# EAGLE design rapidshark-flywheel-controller-mk-1.0 (EAGLE 6.5.0)
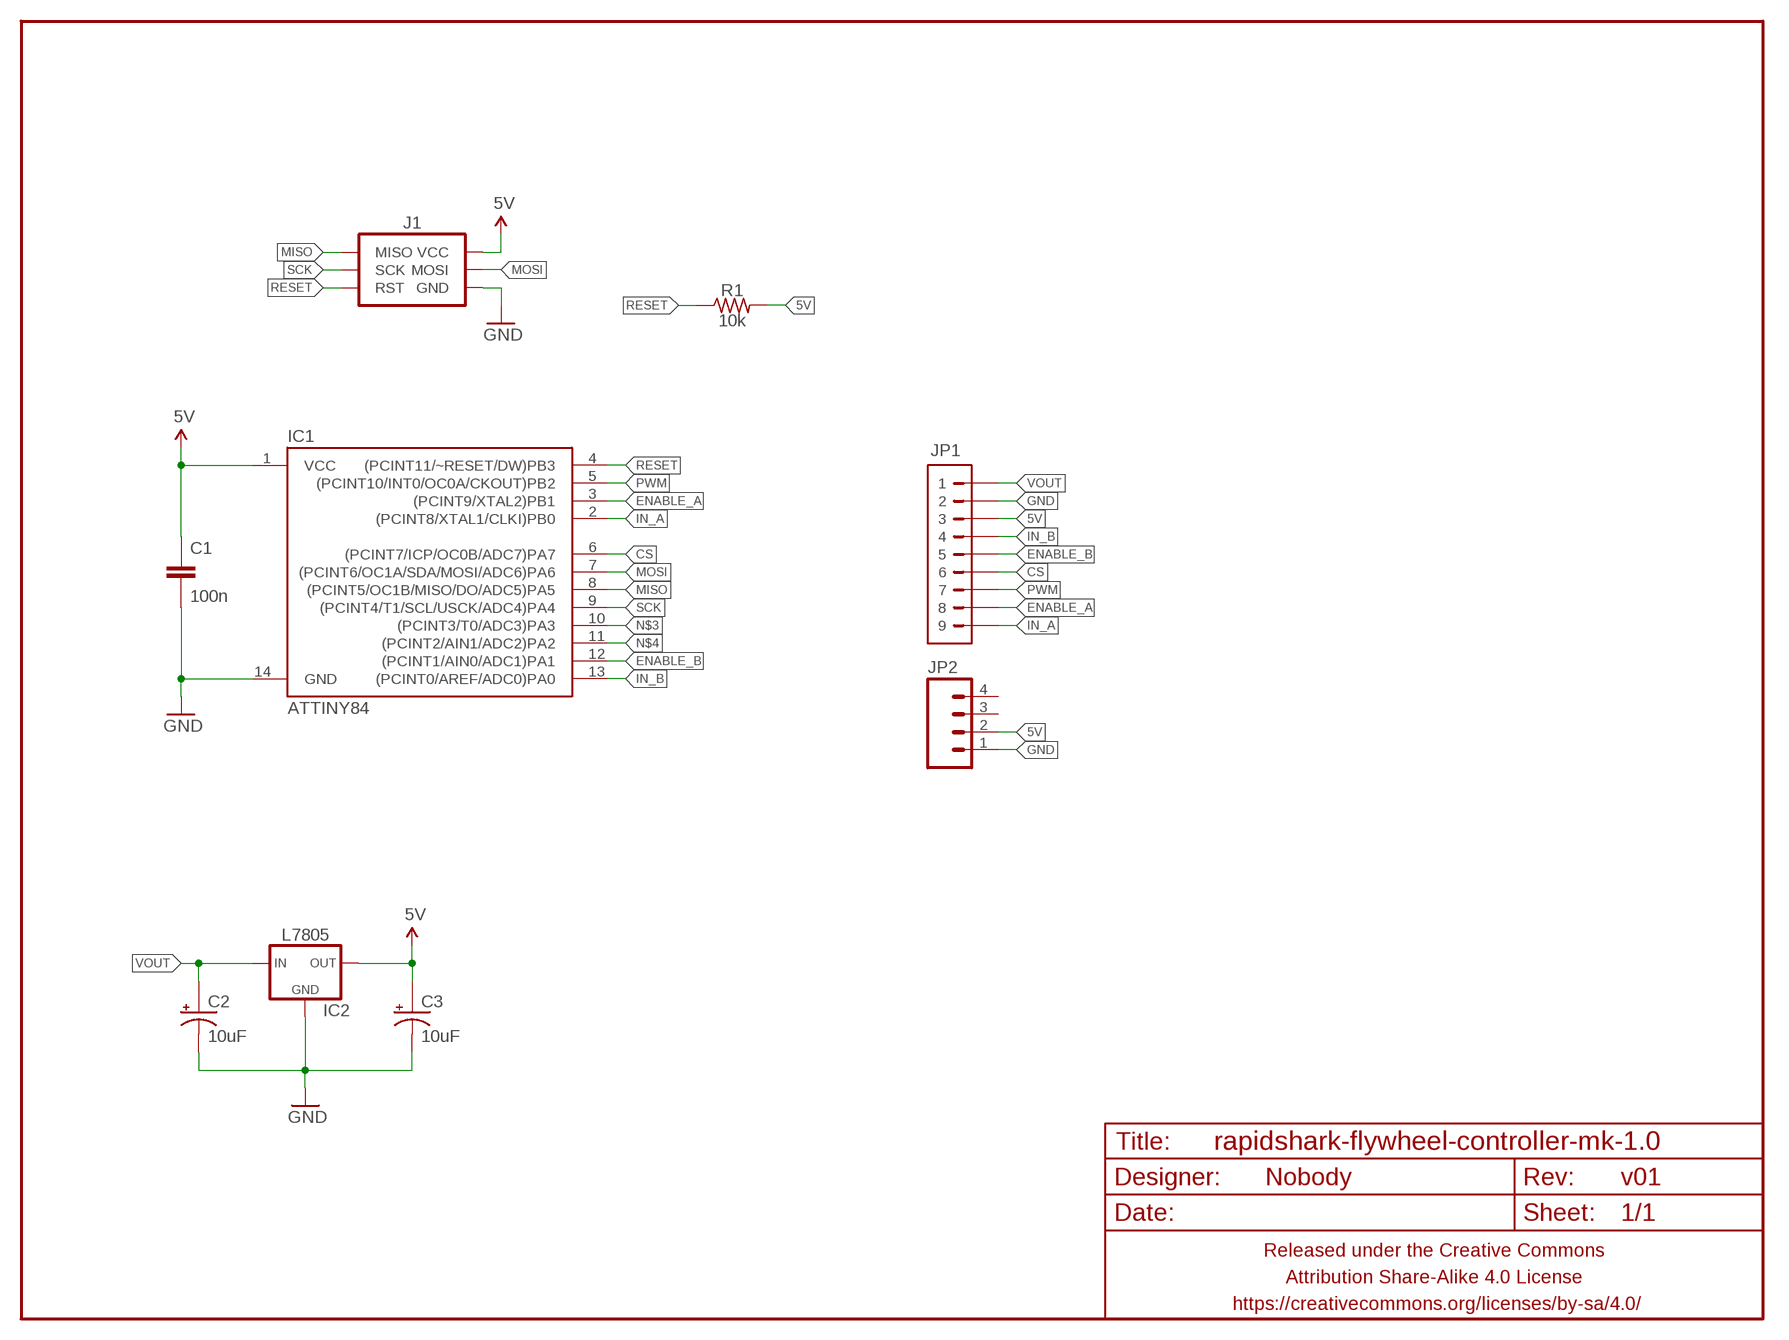
[diagram p0: schematic, sheet 1]

## Parts
C1  100n  CAPACITOR-CERAMICC0805  [C0805]
C2  10uF  CAPACITOR-POLARIZEDE2-5  [E2-5]
C3  10uF  CAPACITOR-POLARIZEDE2-5  [E2-5]
FRAME1  FRAME-LETTERNO_PACKAGE  [DUMMY]
IC1  ATTINY84  [SO14]
IC2  L7805  V_REG_78XXTO-92-INLINE  [TO-92-AMMO]
J1  AVR_SPI_PRG_6PTH  [2X3]
JP1  M09CENTERED  [1X09-CENTERED]
JP2  M04JST-PTH-VERT  [JST-4-PH-VERT-PTH]
R1  10k  RESISTORR0805  [R0805]

## Nets
5V: C1.1 C3.+ IC1.1(VCC) IC2.3(OUT) J1.2(VCC) JP1.3 JP2.2 R1.2
CS: IC1.6((PCINT7/ICP/OC0B/ADC7)PA7) JP1.6
ENABLE_A: IC1.3((PCINT9/XTAL2)PB1) JP1.8
ENABLE_B: IC1.12((PCINT1/AIN0/ADC1)PA1) JP1.5
GND: C1.2 C2.- C3.- IC1.14(GND) IC2.2(GND) J1.6(GND) JP1.2 JP2.1
IN_A: IC1.2((PCINT8/XTAL1/CLKI)PB0) JP1.9
IN_B: IC1.13((PCINT0/AREF/ADC0)PA0) JP1.4
MISO: IC1.8((PCINT5/OC1B/MISO/DO/ADC5)PA5) J1.1(MISO)
MOSI: IC1.7((PCINT6/OC1A/SDA/MOSI/ADC6)PA6) J1.4(MOSI)
N$3: IC1.10((PCINT3/T0/ADC3)PA3)
N$4: IC1.11((PCINT2/AIN1/ADC2)PA2)
PWM: IC1.5((PCINT10/INT0/OC0A/CKOUT)PB2) JP1.7
RESET: IC1.4((PCINT11/~RESET/DW)PB3) J1.5(RST) R1.1
SCK: IC1.9((PCINT4/T1/SCL/USCK/ADC4)PA4) J1.3(SCK)
VOUT: C2.+ IC2.1(IN) JP1.1
Unconnected: JP2.3 JP2.4

## Library data of the parts
C1 = A_butts:CAPACITOR-CERAMIC: CAPACITOR, European symbol
C2 C3 = A_butts:CAPACITOR-POLARIZED: POLARIZED CAPACITOR, American symbol
FRAME1 = A_butts:FRAME-LETTER: Schematic Frame Standard 8.5x11 US Letter frame; DESIGNER: Nobody; VERSION: v01
IC1 = A_butts:ATTINY84: Atmel 14-pin 2/4/8kB flash uC
IC2 = A_butts:V_REG_78XX: Voltage Regulator Standard 7805 5V regulator. IGO (Input Ground Output). Spark Fun Electronics SKU : COM-00107
J1 = A_butts:AVR_SPI_PRG_6: AVR ISP 6 Pin This is the reduced ISP connector for AVR programming. Common on Arduino. This footprint will take up less PCB space and can be used with a 10-pin to 6-pin adapter such as SKU: BOB-08508 **Special note about "TEST_POINT" package. The stop mask is on the top side, so if you want your programming test points to be on the bottom of your board, make sure to place this package on the bottom side of the board. This also ensure that the orientation to program from the bottom side will be correct.
JP1 = A_butts:M09
JP2 = A_butts:M04: Header 4 Standard 4-pin 0.1" header. Use with straight break away headers (SKU : PRT-00116), right angle break away headers (PRT-00553), swiss pins (PRT-00743), machine pins (PRT-00117), and female headers (PRT-00115). Molex polarized connector foot print use with SKU : PRT-08231 with associated crimp pins and housings. 1MM SMD Version SKU: PRT-10208
R1 = A_butts:RESISTOR: RESISTOR, American symbol

## Board
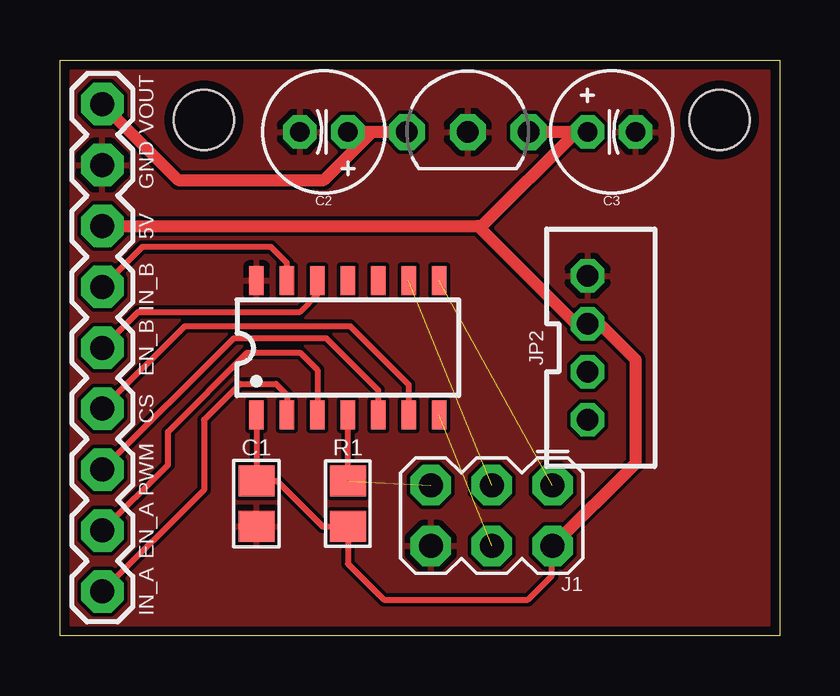
[diagram p1: board, top side]

Size 30 x 24 mm. Coordinates in mm from the lower left corner, seen from the top.
Outline: 30,24 30,0 0,0 0,24 30,24
Copper layers (1*16): Top 0.0356mm / dielectric 1.5011mm / Bottom 0.0356mm
Design rules "LaenPCBOrder_2": minimum track width 6mil, minimum drill 13mil, track to track 6mil, track to pad 6mil, pad to pad 6mil, via to via 6mil, smd to smd 6mil, copper to edge 15mil, drill to drill 6mil, minimum pad ring 7mil, minimum via ring 7mil, stop-mask expansion 3mil, vias tented up to drill 20mil, thermal gap 10mil
Holes 2.5 mm at 6,21.5 27.5,21.5

### Footprints (pad centres in the part's own frame; a part is rotated, then mirrored left to right if it is on the bottom)
C0805 = smd 1.3 x 1.5: 1 -0.95,0; 2 0.95,0
E2-5 = drill 0.8 pad 1.4 octagon: + -1,0; - 1,0
SO14 = smd 0.6 x 1.2: 1 -3.81,-2.8; 2 -2.54,-2.8; 3 -1.27,-2.8; 4 0,-2.8; 5 1.27,-2.8; 6 2.54,-2.8; 7 3.81,-2.8; 8 3.81,2.8; 9 2.54,2.8; 10 1.27,2.8; 11 0,2.8; 12 -1.27,2.8; 13 -2.54,2.8; 14 -3.81,2.8
TO-92-AMMO = drill 0.9 pad 1.5 octagon: 1 -2.54,0; 2 0,0; 3 2.54,0
2X3 = drill 1 pad 1.676 octagon: 1 -2.54,-1.27; 2 -2.54,1.27; 3 0,-1.27; 4 0,1.27; 5 2.54,-1.27; 6 2.54,1.27
1X09-CENTERED = drill 1 pad 1.778 octagon: 1 -10.16,0; 2 -7.62,0; 3 -5.08,0; 4 -2.54,0; 5 0,0; 6 2.54,0; 7 5.08,0; 8 7.62,0; 9 10.16,0
JST-4-PH-VERT-PTH = drill 0.9 pad 1.4 octagon: 1 0,0; 2 2,0; 3 4,0; 4 6,0
R0805 = smd 1.3 x 1.5: 1 -0.95,0; 2 0.95,0

### Placement (x,y rotation side)
C1  8.19,5.5 270 top
C2  11,21 180 top
C3  23,21 0 top
FRAME1  0,0 0 bottom
IC1  12,12 0 top
IC2  17,21 0 top
J1  18,5 180 top
JP1  1.77,12 270 top
JP2  22,15 270 top
R1  12,5.5 270 top

### Tracks (layer width: path | path; a pad name or v marks a point on that pad's centre or on a via)
5V
  Top 0.25: IC1.1 C1.1 9.05,6.45 10.95,4.55 R1.2 12,3 13.5,1.5 19.5,1.5 20.5,2.5 20.5,3.69 J1.2
  Top 0.5: JP1.3 17.42,17.08 | 17.42,17.08 21.5,13 JP2.2 22.5,13 24,11.5 24,7.19 J1.2 | 17.42,17.08 17.58,17.08 21.5,21 | 21.5,21 C3.+ | 21.5,21 IC2.3
CS
  Top 0.25: IC1.6 14.54,10.46 12.1,12.9 5.21,12.9 JP1.6
ENABLE_A
  Top 0.25: IC1.3 10.73,11.07 10,11.8 7.8,11.8 4.5,8.5 4.5,7.11 JP1.8
ENABLE_B
  Top 0.25: JP1.5 3.27,13.5 10,13.5 10.73,14.23 IC1.12
GND
  pour Top: 0,0 0,24 30,24 30,0
IN_A
  Top 0.25: IC1.2 9.46,10.04 9,10.5 7.5,10.5 6,9 6,6.07 JP1.9
IN_B
  Top 0.25: IC1.13 9.46,15.54 8.8,16.2 3.43,16.2 JP1.4
MISO  (1 unrouted)
MOSI  (1 unrouted)
PWM
  Top 0.25: IC1.5 13.27,10.23 11.1,12.4 7.25,12.4 JP1.7
RESET  (1 unrouted)
  Top 0.25: R1.1 IC1.4
SCK  (1 unrouted)
VOUT
  Top 0.5: JP1.1 4.93,19 11,19 13,21 | IC2.1 13,21 | 13,21 C2.+

### Text on the board
tPlace: VOUT | GND | 5V | IN_B | EN_B | CS | PWM | EN_A | IN_A